# Altium project 24V 20CH ESP32 Actuator Controller.PrjPcb (part 2 of 2)
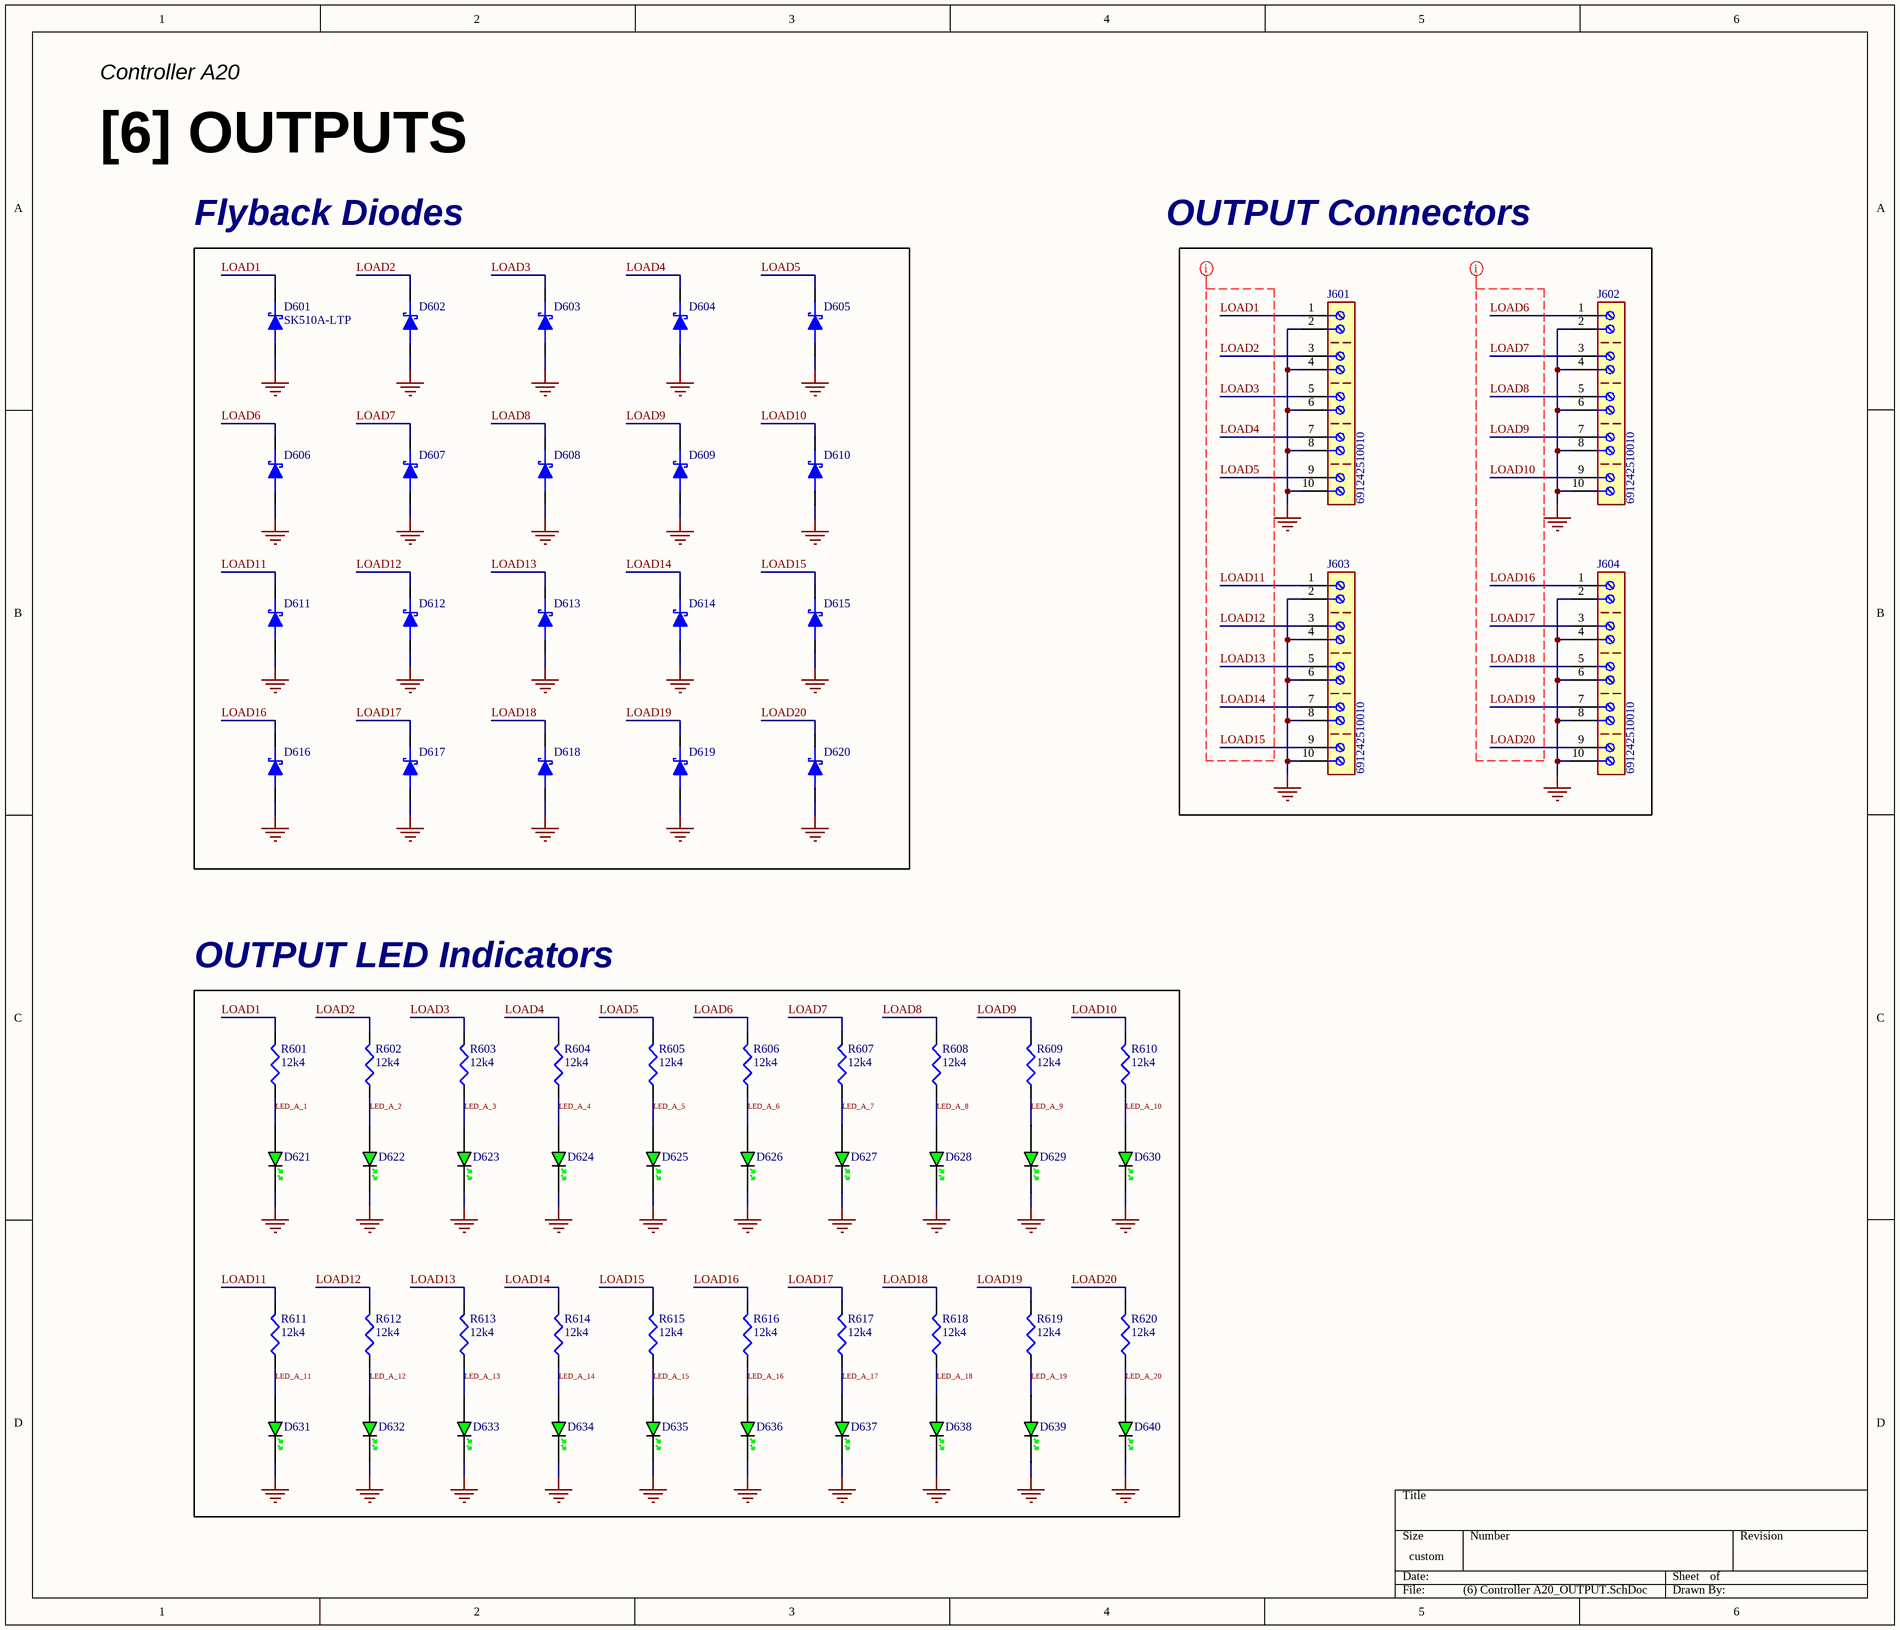
[diagram p6: (6) Controller A20_OUTPUT.SchDoc]

## Nets that join several sheets
+3V3: (1) Controller A20_Power (C103.2 C104.2 U101.1 U101.2), (2) Controller A20_ESP32 (5 pins), (3) Controller A20_Ethernet (18 pins)
+5V: (1) Controller A20_Power (9 pins), (2) Controller A20_ESP32 (D201.2), (4) Controller A20_BUFFERs (10 pins)
+24V: (1) Controller A20_Power (9 pins), (5) Controller A20_SSRs (40 pins)
GND: (1) Controller A20_Power (22 pins), (2) Controller A20_ESP32 (12 pins), (3) Controller A20_Ethernet (23 pins), (4) Controller A20_BUFFERs (30 pins), (5) Controller A20_SSRs (20 pins), (6) Controller A20_OUTPUT (60 pins)
BUFF_IN1: (2) Controller A20_ESP32 (U201.19), (4) Controller A20_BUFFERs (U401.5)
BUFF_IN2: (2) Controller A20_ESP32 (U201.20), (4) Controller A20_BUFFERs (U401.2)
BUFF_IN3: (2) Controller A20_ESP32 (U201.21), (4) Controller A20_BUFFERs (U402.5)
BUFF_IN4: (2) Controller A20_ESP32 (U201.22), (4) Controller A20_BUFFERs (U402.2)
BUFF_IN5: (2) Controller A20_ESP32 (U201.25), (4) Controller A20_BUFFERs (U403.5)
BUFF_IN6: (2) Controller A20_ESP32 (U201.26), (4) Controller A20_BUFFERs (U403.2)
BUFF_IN7: (2) Controller A20_ESP32 (U201.27), (4) Controller A20_BUFFERs (U404.5)
BUFF_IN8: (2) Controller A20_ESP32 (U201.28), (4) Controller A20_BUFFERs (U404.2)
BUFF_IN9: (2) Controller A20_ESP32 (U201.29), (4) Controller A20_BUFFERs (U405.5)
BUFF_IN10: (2) Controller A20_ESP32 (U201.30), (4) Controller A20_BUFFERs (U405.2)
BUFF_IN11: (2) Controller A20_ESP32 (U201.9), (4) Controller A20_BUFFERs (U405.12)
BUFF_IN12: (2) Controller A20_ESP32 (U201.10), (4) Controller A20_BUFFERs (U405.9)
BUFF_IN13: (2) Controller A20_ESP32 (U201.11), (4) Controller A20_BUFFERs (U404.12)
BUFF_IN14: (2) Controller A20_ESP32 (U201.12), (4) Controller A20_BUFFERs (U404.9)
BUFF_IN15: (2) Controller A20_ESP32 (U201.13), (4) Controller A20_BUFFERs (U403.12)
BUFF_IN16: (2) Controller A20_ESP32 (U201.14), (4) Controller A20_BUFFERs (U403.9)
BUFF_IN17: (2) Controller A20_ESP32 (U201.15), (4) Controller A20_BUFFERs (U402.12)
BUFF_IN18: (2) Controller A20_ESP32 (U201.16), (4) Controller A20_BUFFERs (U402.9)
BUFF_IN19: (2) Controller A20_ESP32 (U201.17), (4) Controller A20_BUFFERs (U401.12)
BUFF_IN20: (2) Controller A20_ESP32 (U201.18), (4) Controller A20_BUFFERs (U401.9)
BUFF_OUT1: (4) Controller A20_BUFFERs (U401.6), (5) Controller A20_SSRs (R501.1)
BUFF_OUT2: (4) Controller A20_BUFFERs (U401.3), (5) Controller A20_SSRs (R502.1)
BUFF_OUT3: (4) Controller A20_BUFFERs (U402.6), (5) Controller A20_SSRs (R503.1)
BUFF_OUT4: (4) Controller A20_BUFFERs (U402.3), (5) Controller A20_SSRs (R504.1)
BUFF_OUT5: (4) Controller A20_BUFFERs (U403.6), (5) Controller A20_SSRs (R505.1)
BUFF_OUT6: (4) Controller A20_BUFFERs (U403.3), (5) Controller A20_SSRs (R506.1)
BUFF_OUT7: (4) Controller A20_BUFFERs (U404.6), (5) Controller A20_SSRs (R507.1)
BUFF_OUT8: (4) Controller A20_BUFFERs (U404.3), (5) Controller A20_SSRs (R508.1)
BUFF_OUT9: (4) Controller A20_BUFFERs (U405.6), (5) Controller A20_SSRs (R509.1)
BUFF_OUT10: (4) Controller A20_BUFFERs (U405.3), (5) Controller A20_SSRs (R510.1)
BUFF_OUT11: (4) Controller A20_BUFFERs (U405.11), (5) Controller A20_SSRs (R511.1)
BUFF_OUT12: (4) Controller A20_BUFFERs (U405.8), (5) Controller A20_SSRs (R512.1)
BUFF_OUT13: (4) Controller A20_BUFFERs (U404.11), (5) Controller A20_SSRs (R513.1)
BUFF_OUT14: (4) Controller A20_BUFFERs (U404.8), (5) Controller A20_SSRs (R514.1)
BUFF_OUT15: (4) Controller A20_BUFFERs (U403.11), (5) Controller A20_SSRs (R515.1)
BUFF_OUT16: (4) Controller A20_BUFFERs (U403.8), (5) Controller A20_SSRs (R516.1)
BUFF_OUT17: (4) Controller A20_BUFFERs (U402.11), (5) Controller A20_SSRs (R517.1)
BUFF_OUT18: (4) Controller A20_BUFFERs (U402.8), (5) Controller A20_SSRs (R518.1)
BUFF_OUT19: (4) Controller A20_BUFFERs (U401.11), (5) Controller A20_SSRs (R519.1)
BUFF_OUT20: (4) Controller A20_BUFFERs (U401.8), (5) Controller A20_SSRs (R520.1)
ESP32_EN: (1) Controller A20_Power (U101.4), (2) Controller A20_ESP32 (C203.2 R206.1 SW201.1 U201.45)
ESP32_MISO: (2) Controller A20_ESP32 (U201.33), (3) Controller A20_Ethernet (R305.1)
LOAD1: (5) Controller A20_SSRs (K501.5), (6) Controller A20_OUTPUT (D601.2 J601.1 R601.2)
LOAD2: (5) Controller A20_SSRs (K502.5), (6) Controller A20_OUTPUT (D602.2 J601.3 R602.2)
LOAD3: (5) Controller A20_SSRs (K503.5), (6) Controller A20_OUTPUT (D603.2 J601.5 R603.2)
LOAD4: (5) Controller A20_SSRs (K504.5), (6) Controller A20_OUTPUT (D604.2 J601.7 R604.2)
LOAD5: (5) Controller A20_SSRs (K505.5), (6) Controller A20_OUTPUT (D605.2 J601.9 R605.2)
LOAD6: (5) Controller A20_SSRs (K506.5), (6) Controller A20_OUTPUT (D606.2 J602.1 R606.2)
LOAD7: (5) Controller A20_SSRs (K507.5), (6) Controller A20_OUTPUT (D607.2 J602.3 R607.2)
LOAD8: (5) Controller A20_SSRs (K508.5), (6) Controller A20_OUTPUT (D608.2 J602.5 R608.2)
LOAD9: (5) Controller A20_SSRs (K509.5), (6) Controller A20_OUTPUT (D609.2 J602.7 R609.2)
LOAD10: (5) Controller A20_SSRs (K510.5), (6) Controller A20_OUTPUT (D610.2 J602.9 R610.2)
LOAD11: (5) Controller A20_SSRs (K511.5), (6) Controller A20_OUTPUT (D611.2 J603.1 R611.2)
LOAD12: (5) Controller A20_SSRs (K512.5), (6) Controller A20_OUTPUT (D612.2 J603.3 R612.2)
LOAD13: (5) Controller A20_SSRs (K513.5), (6) Controller A20_OUTPUT (D613.2 J603.5 R613.2)
LOAD14: (5) Controller A20_SSRs (K514.5), (6) Controller A20_OUTPUT (D614.2 J603.7 R614.2)
LOAD15: (5) Controller A20_SSRs (K515.5), (6) Controller A20_OUTPUT (D615.2 J603.9 R615.2)
LOAD16: (5) Controller A20_SSRs (K516.5), (6) Controller A20_OUTPUT (D616.2 J604.1 R616.2)
LOAD17: (5) Controller A20_SSRs (K517.5), (6) Controller A20_OUTPUT (D617.2 J604.3 R617.2)
LOAD18: (5) Controller A20_SSRs (K518.5), (6) Controller A20_OUTPUT (D618.2 J604.5 R618.2)
LOAD19: (5) Controller A20_SSRs (K519.5), (6) Controller A20_OUTPUT (D619.2 J604.7 R619.2)
LOAD20: (5) Controller A20_SSRs (K520.5), (6) Controller A20_OUTPUT (D620.2 J604.9 R620.2)
W5500_CLK: (2) Controller A20_ESP32 (R204.1), (3) Controller A20_Ethernet (U302.33)
W5500_CS: (2) Controller A20_ESP32 (R205.1), (3) Controller A20_Ethernet (R303.1 U302.32)
W5500_INTn: (2) Controller A20_ESP32 (U201.6), (3) Controller A20_Ethernet (R319.1 U302.36)
W5500_LINKn: (2) Controller A20_ESP32 (U201.5), (3) Controller A20_Ethernet (J301.10 U302.25)
W5500_MOSI: (2) Controller A20_ESP32 (R203.1), (3) Controller A20_Ethernet (U302.35)